# Altium project Lion tracker.PrjPCB (part 1 of 3)
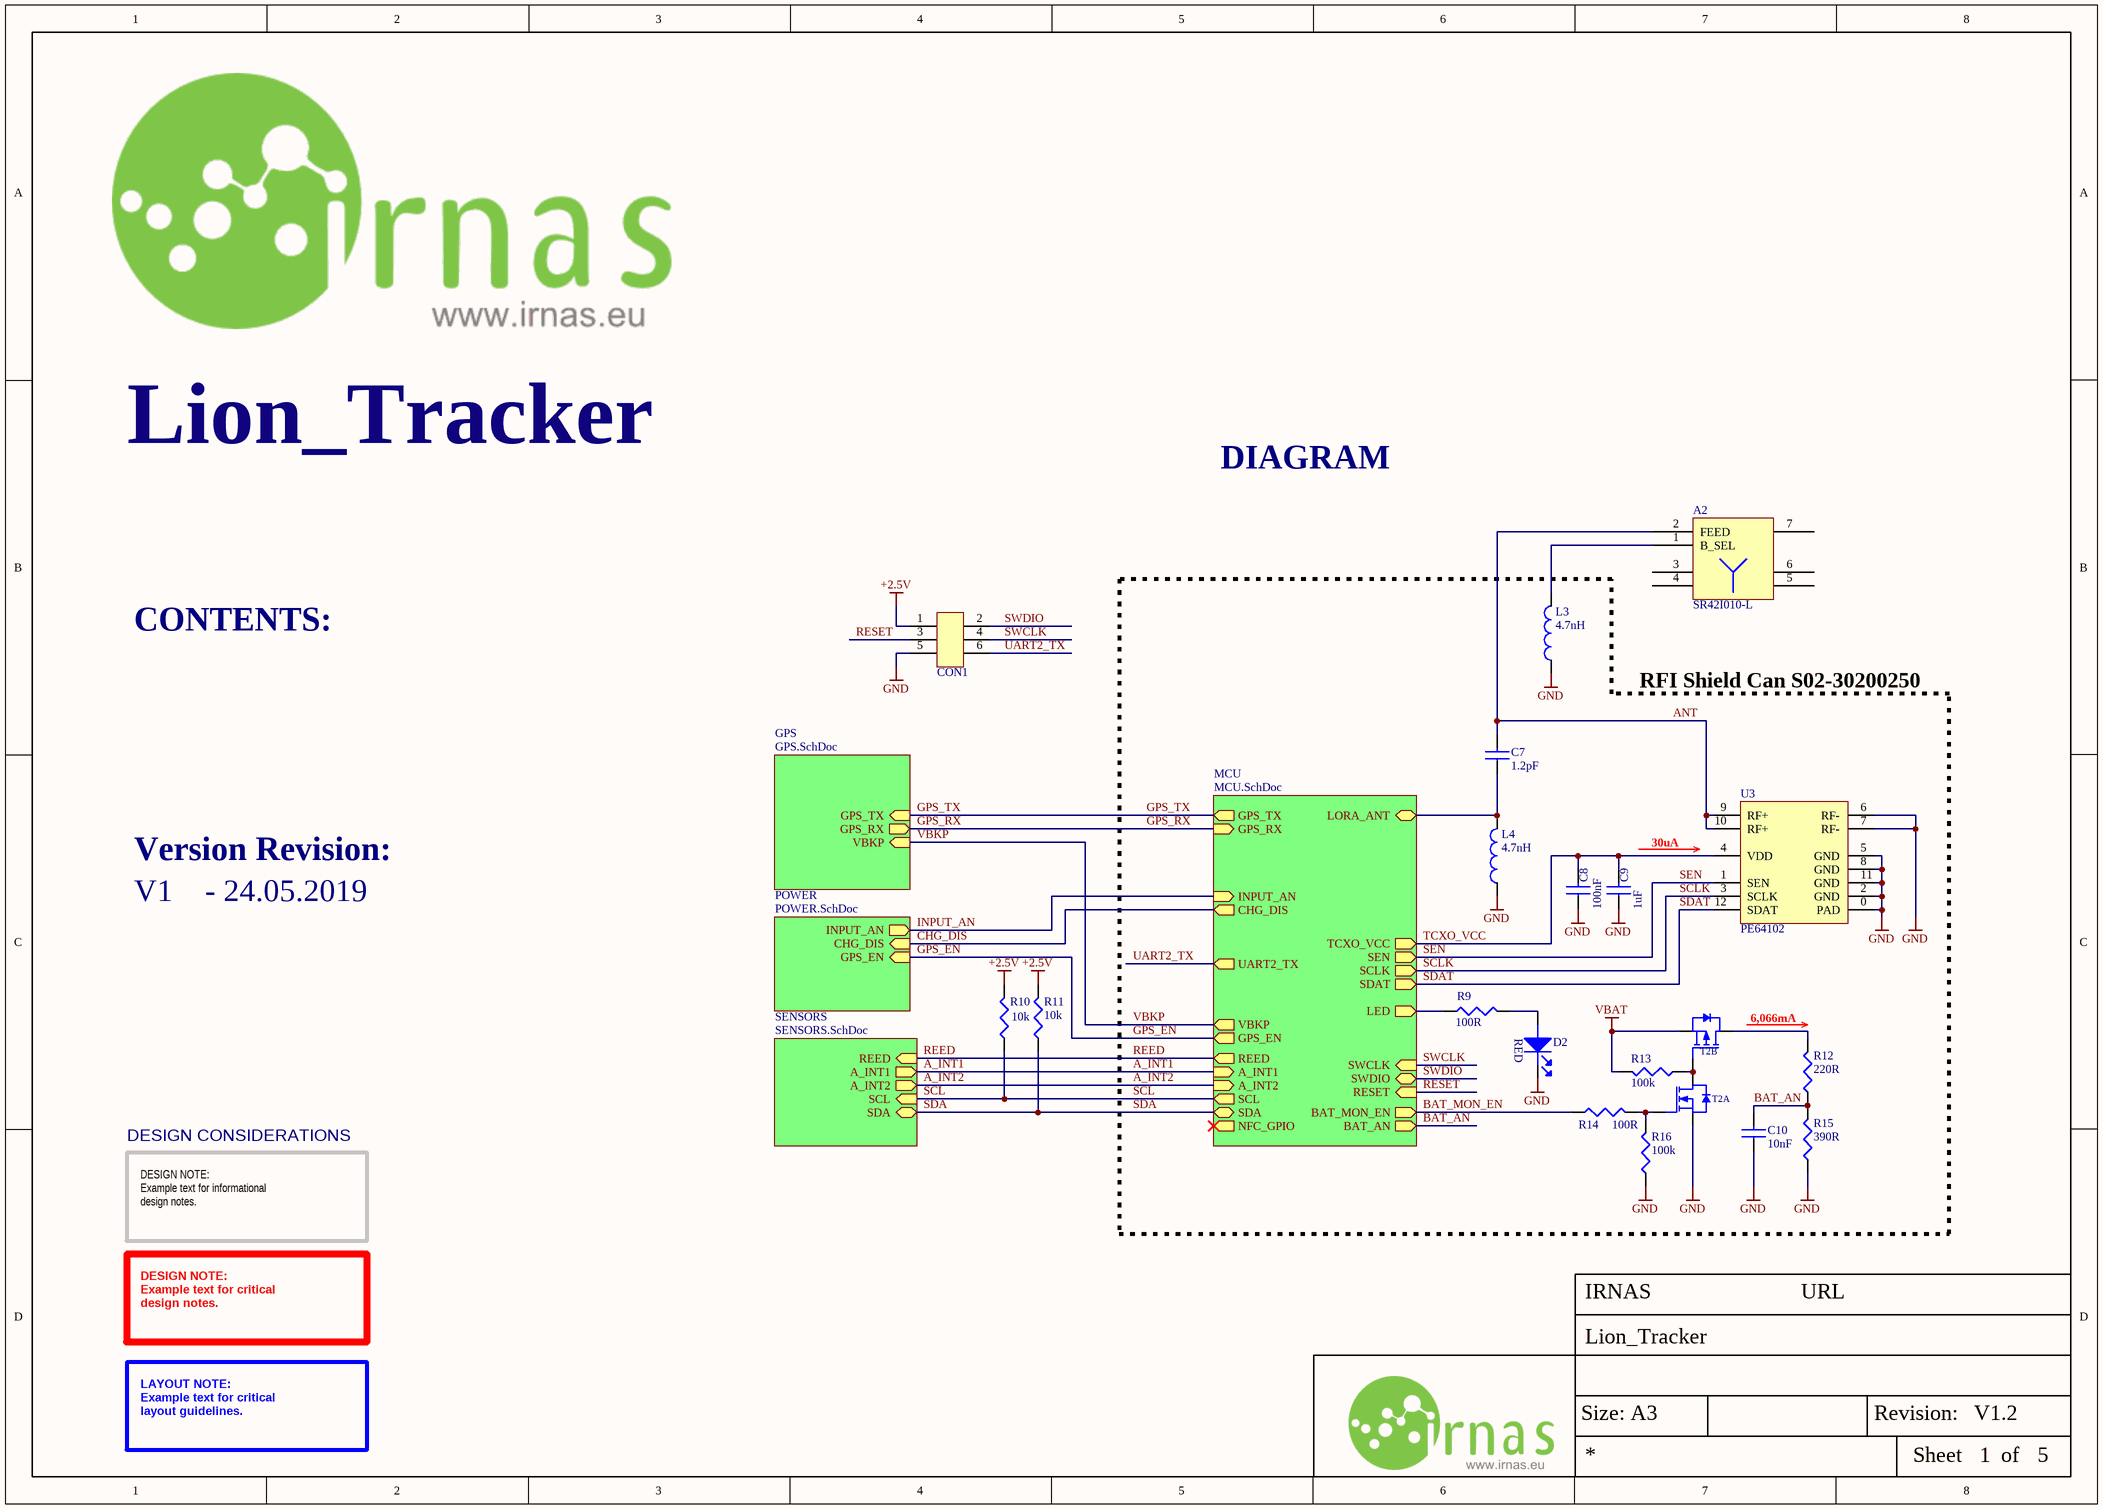
[diagram p0: MAIN.SchDoc]
Company: IRNAS; CreateDate: 25.09.2019; PCBDesigner: Aleksej Cegner; ProjectTitle: Lion_Tracker; RevisionDate: 29.10.2019; Version: V1.2; Website: URL
4 sheets, 116 parts. Net scope: hierarchical (ports join the sheet entries above them; power ports are global).
Board files: LION_TRACKER.PcbDoc, LION_TRACKER_PANEL.PcbDoc
Sheets:
  MAIN.SchDoc
    SENSORS = SENSORS.SchDoc
    MCU = MCU.SchDoc
    POWER = POWER.SchDoc

## Sheet MAIN.SchDoc
size A3; DocumentNumber: 1; SheetNumber: 1; SheetTotal: 5

### Parts
A2  SR42I010-L  [SR42I010-L]
C7  1.2pF  [CAP0402]
C8  100nF  [CAP0402]
C9  1uF  [CAP0402]
C10  10nF  [CAP0402]
CON1  Tag connect  [TC2030-IDC-NL]  (value not drawn)  (no BOM)
D2  LED RED  [LED0603]  (value not drawn)
L3  4.7nH  [IND0402]
L4  4.7nH  [IND0402]
R9  100R  [RES0402]
R10  10k  [RES0402]
R11  10k  [RES0402]
R12  220R  [RES0402]
R13  100k  [RES0402]
R14  100R  [RES0402]
R15  390R  [RES0402]
R16  100k  [RES0402]
T2  VT6M1T2CR  [VMT6]  (value not drawn)  (parts A,B of 2)
U3  PE64102  [QFN-12]

### Sub-sheets
GPS = GPS.SchDoc (file not in this document): VBKP (in), GPS_RX (out), GPS_TX (in)
MCU = MCU.SchDoc: RESET (in), GPS_RX (in), SCL (out), LORA_ANT (bidir), SWDIO (bidir), GPS_EN (out), GPS_TX (out), SWCLK (in), SDA (bidir), A_INT2 (in), A_INT1 (in), REED (out), VBKP (out), BAT_AN (out), BAT_MON_EN (out), LED (out), UART2_TX (out), NFC_GPIO (out), SDAT (out), SCLK (out), SEN (out), INPUT_AN (in), CHG_DIS (out), TCXO_VCC (out)
POWER = POWER.SchDoc: GPS_EN (in), CHG_DIS (in), INPUT_AN (out)
SENSORS = SENSORS.SchDoc: SCL (in), SDA (bidir), REED (in), A_INT2 (out), A_INT1 (out)

### Nets
+2.5V: CON1.1 R10.2 R11.2
GND: C8.1 C9.1 C10.1 CON1.5 D2.1(cathode) L3.1 L4.1 R15.1 R16.1 T2.1(S1) U3.0(PAD) U3.2(GND) U3.5(GND) U3.6(RF-) U3.7(RF-) U3.8(GND) U3.11(GND)
VBAT: R13.2 T2.4(S2)
A_INT1: sheet SENSORS/A_INT1, sheet MCU/A_INT1
A_INT2: sheet SENSORS/A_INT2, sheet MCU/A_INT2
ANT: A2.2(FEED) C7.2 U3.9(RF+) U3.10(RF+)
BAT_AN: C10.2 R12.1 R15.2 ; sheet MCU/BAT_AN
BAT_MON_EN: R14.1 ; sheet MCU/BAT_MON_EN
CHG_DIS: sheet MCU/CHG_DIS, sheet POWER/CHG_DIS
GPS_EN: sheet MCU/GPS_EN, sheet POWER/GPS_EN
GPS_RX: sheet MCU/GPS_RX, sheet GPS/GPS_RX
GPS_TX: sheet MCU/GPS_TX, sheet GPS/GPS_TX
INPUT_AN: sheet MCU/INPUT_AN, sheet POWER/INPUT_AN
LED: R9.1 ; sheet MCU/LED
LORA_ANT: C7.1 L4.2 ; sheet MCU/LORA_ANT
REED: sheet SENSORS/REED, sheet MCU/REED
RESET: CON1.3 ; sheet MCU/RESET
SCL: R10.1 ; sheet SENSORS/SCL, sheet MCU/SCL
SCLK: U3.3(SCLK) ; sheet MCU/SCLK
SDA: R11.1 ; sheet SENSORS/SDA, sheet MCU/SDA
SDAT: U3.12(SDAT) ; sheet MCU/SDAT
SEN: U3.1(SEN) ; sheet MCU/SEN
SWCLK: CON1.4 ; sheet MCU/SWCLK
SWDIO: CON1.2 ; sheet MCU/SWDIO
TCXO_VCC: C8.2 C9.2 U3.4(VDD) ; sheet MCU/TCXO_VCC
UART2_TX: CON1.6 ; sheet MCU/UART2_TX
VBKP: sheet MCU/VBKP, sheet GPS/VBKP
NetA2_1: A2.1(B_SEL) L3.2
NetD2_2: D2.2(ANODE) R9.2
NetR12_2: R12.2 T2.3(D2)
NetR13_1: R13.1 T2.5(G2) T2.6(D1)
NetR14_2: R14.2 R16.2 T2.2(G1)

Not connected (* = marked no-connect by the designer): A2 3 4 5 6 7

### Notes on the sheet
- DIAGRAM
- CONTENTS:
- RFI Shield Can S02-30200250
- 30uA
- Version Revision:
- V1    - 24.05.2019
- 6,066mA
- DESIGN CONSIDERATIONS
- DESIGN NOTE:
  Example text for informational
  design notes.
- DESIGN NOTE:
  Example text for critical
  design notes.
- LAYOUT NOTE:
  Example text for critical
  layout guidelines.
- Size: A3
- Revision:
- Sheet
- of
- (in symbol LED - LED RED) RED

### Library data of the parts
A2 = ANT - SR42I010-L: Antenna SMD -4dBi Gain 870MHz/928MHz Automotive 7-Pin SMD T/R; Manufacturer: Antenova; Manufacturer Part Number: SR42I010-R; Stock 1: 3154; Pricing 1: 1 = 2.36000, 10 = 1.90000, 50 = 1.90000, 100 = 1.52000, 1000 = 1.07000, 10000 = 0.95900 (USD); Supplier 1: Mouser; Supplier Part Number 1: 237-SR42I010-L
C7 = C - 4.7nF/0402: CAP CER 4700PF 50V X7R 0402; Manufacturer: KEMET; Manufacturer Part Number: C0402C472K5RAC-TU; IRNAS Part No.: /; Dielectric Material: Ceramic; Capacitance: 4.7nF; Tolerance: 10%; Supplier 1: Farnell; Stock 1: 98953; Pricing 1: 10=0.0321, 100=0.0144, 500=0.0081, 2500=0.0057, 5000=0.0048 (EUR); Mount: Surface Mount,PCB; Case/Package: 0402; Number of Pins: 2; Case Code (Imperial): 0402; Case Code (Metric): 1005; Min Operating Temperature: -55°C; Max Operating Temperature: 125°C; Voltage Rating: 50V; Voltage Rating (DC): 50V; Packaging: Tape and Reel; Package Quantity: 1; Dielectric: X7R; Termination: SMD/SMT; Voltage: 50V; Length: 1mm; Height: 0.5mm; Width: 0.02inch; Lead Pitch: 0.3mm; Thickness: 0.022inch; Depth: 0.5mm; Radiation Hardening: No; REACH SVHC: No SVHC; ComponentLink1URL: https://datasheet.ciiva.com/7747/40889-7747549.pdf; ComponentLink1Description: https://datasheet.ciiva.com/7747/40889-7747549.pdf; ComponentLink2URL: https://datasheet.ciiva.com/7747/40889-7747550.pdf; ComponentLink2Description: https://datasheet.ciiva.com/7747/40889-7747550.pdf; ComponentLink3URL: https://datasheet.ciiva.com/14604/70095383-14604382.pdf; ComponentLink3Description: https://datasheet.ciiva.com/14604/70095383-14604382.pdf; ComponentLink4URL: https://datasheet.ciiva.com/6074/kem-c1002-x7r-smd-6074645.pdf; ComponentLink4Description: https://datasheet.ciiva.com/6074/kem-c1002-x7r-smd-6074645.pdf; ComponentLink5URL: https://datasheet.ciiva.com/14602/70095383-14602057.pdf; ComponentLink5Description: https://datasheet.ciiva.com/14602/70095383-14602057.pdf; ComponentLink6URL: https://datasheet.ciiva.com/18102/getdatasheetpartid-63228-18102058.pdf; ComponentLink6Description: https://datasheet.ciiva.com/18102/getdatasheetpartid-63228-18102058.pdf; Supplier Part Number 1: 1414594
C8 = C - 100nF/0402: MULTICOMP         MC0402X104J160CT             SMD Multilayer Ceramic Capacitor, 0402 [1005 Metric], 0.1 F, 16 V,  5%, X5R, MC Series                          New; IRNAS Part No.: /; Voltage Rating: 16V; Supplier 1: Farnell; Manufacturer: Multicomp; Manufacturer Part Number: MC0402X104J160CT; Stock 1: 3230; Pricing 1: 10=0.0139, 100=0.0108, 500=0.0076, 2500=0.0051, 5000=0.0038 (EUR); Case Code (Metric): 1005; Case Code (Imperial): 0402; Min Operating Temperature: -55°C; Max Operating Temperature: 85°C; Capacitance: 100nF; Dielectric: X5R; Packaging: Tape and Reel; Tolerance: 5%; Voltage Rating (DC): 16V; REACH SVHC: No SVHC; ComponentLink1URL: http://www.farnell.com/datasheets/2117933.pdf; ComponentLink1Description: http://www.farnell.com/datasheets/2117933.pdf; ComponentLink2URL: http://www.farnell.com/datasheets/2117900.pdf; ComponentLink2Description: http://www.farnell.com/datasheets/2117900.pdf; Supplier Part Number 1: 2627419
C9 = C - 1uF/0402: CAP CER 1UF 10V 20% X5R 0402; Manufacturer: Murata; Manufacturer Part Number: GRM155R61A105ME15D; IRNAS Part No.: /; Supplier 1: Farnell; Stock 1: 0; Pricing 1: 10=0.0379, 100=0.0266, 500=0.0156, 2500=0.0098, 5000=0.0083 (EUR); Mount: Surface Mount; Case/Package: 0402; Case Code (Metric): 1005; Case Code (Imperial): 0402; Min Operating Temperature: -55°C; Max Operating Temperature: 85°C; Capacitance: 1uF; Tolerance: 20%; Voltage Rating: 10V; Packaging: Tape and Reel; Package Quantity: 1; Dielectric: X5R; Voltage: 10V; Voltage Rating (DC): 10V; Length: 1mm; Height: 0.5mm; Width: 0.02inch; Thickness: 0.022inch; Depth: 0.5mm; Radiation Hardening: No; REACH SVHC: No SVHC; Lead Free: Lead Free; ComponentLink1URL: https://datasheet.ciiva.com/164/product-164665.pdf; ComponentLink1Description: https://datasheet.ciiva.com/164/product-164665.pdf; ComponentLink2URL: https://datasheet.ciiva.com/11616/product-11616508.pdf; ComponentLink2Description: https://datasheet.ciiva.com/11616/product-11616508.pdf; ComponentLink3URL: https://datasheet.ciiva.com/46418/1769893-46418047.pdf; ComponentLink3Description: https://datasheet.ciiva.com/46418/1769893-46418047.pdf; ComponentLink4URL: https://datasheet.ciiva.com/164/partnumbering-e-01-164666.pdf; ComponentLink4Description: https://datasheet.ciiva.com/164/partnumbering-e-01-164666.pdf; ComponentLink5URL: https://datasheet.ciiva.com/164/partnumbering-e-01-164667.pdf; ComponentLink5Description: https://datasheet.ciiva.com/164/partnumbering-e-01-164667.pdf; Supplier Part Number 1: 2426953
C10 = C - 10nF/0402: CAP CER 10000PF 16V X7R 0402; Manufacturer: Murata; Manufacturer Part Number: GRM155R71C103KA01D; IRNAS Part No.: /; Tolerance: 10%; Supplier 1: Farnell; Stock 1: 16478; Pricing 1: 10=0.0216, 100=0.0151, 500=0.0104, 2500=0.0069, 5000=0.0056 (EUR); Mount: Surface Mount; Case/Package: 0402; Number of Pins: 2; Case Code (Metric): 1005; Case Code (Imperial): 0402; Min Operating Temperature: -55°C; Max Operating Temperature: 125°C; Package Quantity: 1; Capacitance: 10nF; Voltage Rating: 16V; Packaging: Tape and Reel; Voltage Rating (DC): 16V; Dielectric: X7R; Termination: SMD/SMT; Voltage: 16V; Length: 1mm; Height: 0.5mm; Width: 0.02inch; Thickness: 0.022inch; Depth: 0.5mm; Radiation Hardening: No; REACH SVHC: No SVHC; Lead Free: Lead Free; ComponentLink1URL: https://datasheet.ciiva.com/129/partnumbering-e-01-129774.pdf; ComponentLink1Description: https://datasheet.ciiva.com/129/partnumbering-e-01-129774.pdf; ComponentLink2URL: https://datasheet.ciiva.com/129/partnumbering-e-01-129775.pdf; ComponentLink2Description: https://datasheet.ciiva.com/129/partnumbering-e-01-129775.pdf; ComponentLink3URL: https://datasheet.ciiva.com/129/product-129776.pdf; ComponentLink3Description: https://datasheet.ciiva.com/129/product-129776.pdf; ComponentLink4URL: https://datasheet.ciiva.com/18184/getdatasheetpartid-178863-18184649.pdf; ComponentLink4Description: https://datasheet.ciiva.com/18184/getdatasheetpartid-178863-18184649.pdf; ComponentLink5URL: https://datasheet.ciiva.com/22698/608985-22698415.pdf; ComponentLink5Description: https://datasheet.ciiva.com/22698/608985-22698415.pdf; ComponentLink6URL: https://datasheet.ciiva.com/7937/608985-7937614.pdf; ComponentLink6Description: https://datasheet.ciiva.com/7937/608985-7937614.pdf; Supplier Part Number 1: 1828864
CON1 = tag connecot 6 pin
D2 = LED - LED RED: BROADCOM LIMITED - HSMS-C190 - LED, RED, 10MCD, 626NM; LED Mounting: SMD; Forward Current If: 20; Forward Voltage: 2.1; Wavelength Typ: 626; Luminous Intensity: 10; Viewing Angle: 170°; Lens Shape: Rectangular; SVHC: No SVHC (17-Dec-2015)<!--FANDB--><div class="features-and-benefits-container"><div class="features-and-benefits-description"><span class="features-benefits-value">The HSMS-C190 is a HER SMD Chip LED with untinted/diffused lens, made of GaP. It is designed in an industry standard package 1.6 x 0.8mm footprint with 0.8mm profile. It is compatible with IR reflow solder processes. The small size and wide viewing angle make this LED prime choices for backlighting applications and front panel illumination especially where space is a premium.</span></div><div class="features-and-benefits-list"><ul class="features-and-benefits-list-list"><li class="features-and-benefits-list-item">Small size</li><li class="features-and-benefits-list-item">Industry standard footprint</li><li class="features-and-benefits-list-item">Compatible with IR solder</li><li class="features-and-benefits-list-item">Diffused optics</li><li class="features-and-benefits-list-item">-40 to 85; Supplier 1: Farnell; Manufacturer: BROADCOM LIMITED; Manufacturer Part Number: HSMS-C190; RoHS: YES; Stock 1: 7534; Pricing 1: 1=0.361, 10=0.256, 50=0.235, 100=0.106, 200=0.101 (GBP); LED Colour: Red; Bulb Size: -; Packaging: Cut Tape; Product Range: -; Automotive Qualification Standard: -; MSL: -; ComponentLink1URL: http://www.farnell.com/datasheets/313031.pdf; ComponentLink1Description: http://www.farnell.com/datasheets/313031.pdf; ComponentLink2URL: http://www.farnell.com/datasheets/1681524.pdf; ComponentLink2Description: http://www.farnell.com/datasheets/1681524.pdf; ComponentLink3URL: http://www.farnell.com/datasheets/2165483.pdf; ComponentLink3Description: http://www.farnell.com/datasheets/2165483.pdf; Supplier Part Number 1: 2497356
L3 L4 = L - 4.3nH/0402: Inductor RF Chip Multi-Layer 4.3nH 0.3nH 100MHz 8Q-Factor Air 300mA 210mOhm DCR 0402 Paper T/R; Manufacturer: Murata; Manufacturer Part Number: LQG15HN4N3S02D; IRNAS Part No.: /; Q Factor: 8; Self Resonant Frequency: 6GHz; Shielding: Unshielded; DC Resistance (DCR): 210mR; Stock 1: 3502; Pricing 1: 1 = 0.10000, 10 = 0.06100, 100 = 0.04040, 500 = 0.03366, 1000 = 0.02827, 2500 = 0.02423 (USD); RoHS: Yes; Mount: Surface Mount; Case/Package: 0402; Core Material: Air; Case Code (Metric): 1005; Case Code (Imperial): 0402; Min Operating Temperature: -55°C; Max Operating Temperature: 125°C; Package Quantity: 10000; Packaging: Tape and Reel; Current Rating: 300mA; Inductance: 4.3nh; Test Frequency: 100MHz; Max DC Current: 300mA; Termination: SMD/SMT; Current: 300mA; DC Current: 300mA; Military Standard: Not; Length: 1.05mm; Height: 0.5mm; Width: 0.02inch; Height - Seated (Max): 0.022inch; Depth: 0.55mm; Radiation Hardening: No; REACH SVHC: No SVHC; Lead Free: Lead Free; ComponentLink1URL: http://uk.rs-online.com/webdocs/0f10/0900766b80f10808.pdf?src-supplier=RSComponents; ComponentLink1Description: http://uk.rs-online.com/webdocs/0f10/0900766b80f10808.pdf?src-supplier=RSComponents; ComponentLink2URL: http://search.murata.co.jp/Ceramy/image/img/PDF/ENG/L0075S0083LQG15HN.pdf?src-supplier=Avnet; ComponentLink2Description: http://search.murata.co.jp/Ceramy/image/img/PDF/ENG/L0075S0083LQG15HN.pdf?src-supplier=Avnet; ComponentLink3URL: http://www.farnell.com/datasheets/66026.pdf?src-supplier=Element14; ComponentLink3Description: http://www.farnell.com/datasheets/66026.pdf?src-supplier=Element14; ComponentLink4URL: https://www.verical.com/server-webapp/html/getDatasheet?partID=31252&src-supplier=Verical; ComponentLink4Description: https://www.verical.com/server-webapp/html/getDatasheet?partID=31252&src-supplier=Verical; ComponentLink5URL: http://search.murata.co.jp/Ceramy/image/img/PDF/ENG/L0075S0083LQG15HN.pdf?src-supplier=Avnet+Europe; ComponentLink5Description: http://search.murata.co.jp/Ceramy/image/img/PDF/ENG/L0075S0083LQG15HN.pdf?src-supplier=Avnet+Europe; ComponentLink6URL: https://search.murata.co.jp/Ceramy/image/img/P02/partnumberingAT_LQ3E.pdf?src-supplier=Digi-Key; ComponentLink6Description: https://search.murata.co.jp/Ceramy/image/img/P02/partnumberingAT_LQ3E.pdf?src-supplier=Digi-Key; Supplier 1: Farnell; Supplier Part Number 1: 1711735
R9 R14 = R - 100R/0402: MULTICOMP         MCMR04X1000FTL            SMD Chip Resistor, Ceramic, MCMR Series, 100 ohm, 50 V, 0402 [1005 Metric], 62.5 mW,  1%; IRNAS Part No.: /; Temperature Coefficient: 100ppm/°C; Power Rating: 62.5mW; Voltage Rating: 50V; Supplier 1: Farnell; Manufacturer: Multicomp; Manufacturer Part Number: MCMR04X1000FTL; Stock 1: 62365; Pricing 1: 10=0.0071, 100=0.0042, 500=0.003, 2500=0.0024, 5000=0.0019 (GBP); Case/Package: 0402; Case Code (Metric): 1005; Case Code (Imperial): 0402; Resistance: 100R; Tolerance: 1%; Composition: Ceramic; Packaging: Cut Tape; Voltage Rating (DC): 50V; REACH SVHC: No SVHC; ComponentLink1URL: https://datasheet.ciiva.com/28692/1716705-28692087.pdf; ComponentLink1Description: https://datasheet.ciiva.com/28692/1716705-28692087.pdf; ComponentLink2URL: https://datasheet.ciiva.com/22708/1716705-22708156.pdf; ComponentLink2Description: https://datasheet.ciiva.com/22708/1716705-22708156.pdf; Supplier Part Number 1: 2072515
R10 R11 = R - 10k/0402: MULTICOMP         MCWR04X1002FTL             SMD Chip Resistor, Thick Film, 10 kohm, 50 V, 0402 [1005 Metric], 62.5 mW,  1%, MCWR Series; IRNAS Part No.: I-100014; Resistance: 10kR; Voltage Rating: 50V; Power Rating: 62.5mW; Temperature Coefficient: 100ppm/°C; Supplier 1: Farnell; Manufacturer: Multicomp; Manufacturer Part Number: MCWR04X1002FTL; Stock 1: 602609; Pricing 1: 10=0.0029, 100=0.0017, 500=0.0012, 2500=0.001, 5000=0.0008 (EUR); Case/Package: 0402; Case Code (Metric): 1005; Case Code (Imperial): 0402; Packaging: Cut Tape; Composition: Thick Film; Tolerance: 1%; Voltage Rating (DC): 50V; REACH SVHC: No SVHC; ComponentLink1URL: http://www.farnell.com/datasheets/1849611.pdf; ComponentLink1Description: http://www.farnell.com/datasheets/1849611.pdf; Supplier Part Number 1: 2447096
R12 = R - 220R/0402: SMD Chip Resistor, 0402 [1005 Metric], 220 ohm, CRCW e3 Series, 50 V, Thick Film, 63 mW; Manufacturer: Multicomp; IRNAS Part No.: /; Voltage Rating: 50V; Power Rating: 62.5mW; Temperature Coefficient: 400ppm/°C; Stock 1: 0; Pricing 1: 10=0.0057, 100=0.0034, 500=0.0024, 2500=0.0019, 5000=0.0015 (EUR); Case/Package: 0402; Case Code (Metric): 1005; Case Code (Imperial): 0402; Packaging: Cut Tape; Resistance: 220R; Composition: Ceramic; Voltage Rating (DC): 50V; REACH SVHC: No SVHC; ComponentLink1URL: http://www.farnell.com/datasheets/2310790.pdf?_ga=2.80708247.1822379758.1564985606-1373726713.1554121096&_gac=1.157944520.1562763802.CjwKCAjwmZbpBRAGEiwADrmVXm8xT8OHDZvJe8qZIQyyGmIuiUD-TEITatw0hIdDkyBwIXXCH7oneRoCl7cQAvD_BwE; ComponentLink1Description: Datasheet; Supplier 1: Farnell; Supplier Part Number 1: 2140704
R13 R16 = R - 100k/0402: MULTICOMP   MCWR04X1003FTL   RES, THICK FILM, 100KOHM, 1%, 0.0625W; IRNAS Part No.: I-100013; Resistance: 100kR; Power Rating: 62.5mW; Voltage Rating: 50V; Temperature Coefficient: 100ppm/°C; Supplier 1: Farnell; Manufacturer: Multicomp; Manufacturer Part Number: MCWR04X1003FTL; Stock 1: 161188; Pricing 1: 10=0.0029, 100=0.0017, 500=0.0012, 2500=0.001, 5000=0.0008 (EUR); Mount: Surface Mount; Case/Package: 0402; Case Code (Metric): 1005; Case Code (Imperial): 0402; Tolerance: 1%; Packaging: Cut Tape; Composition: Thick Film; Voltage Rating (DC): 50V; REACH SVHC: No SVHC; ComponentLink1URL: https://datasheet.ciiva.com/46386/1849611-46386524.pdf; ComponentLink1Description: https://datasheet.ciiva.com/46386/1849611-46386524.pdf; Supplier Part Number 1: 2447094
R15 = R - 390R/0402: SMD Chip Resistor, 0402 [1005 Metric], 390 ohm, MCWR Series, 50 V, Thick Film, 62.5 mW; Manufacturer: Multicomp; IRNAS Part No.: /; Voltage Rating: 50V; Power Rating: 62.5mW; Temperature Coefficient: 400ppm/°C; Stock 1: 0; Pricing 1: 10=0.0057, 100=0.0034, 500=0.0024, 2500=0.0019, 5000=0.0015 (EUR); Case/Package: 0402; Case Code (Metric): 1005; Case Code (Imperial): 0402; Packaging: Cut Tape; Resistance: 390R; Composition: Ceramic; Voltage Rating (DC): 50V; REACH SVHC: No SVHC; ComponentLink1URL: http://www.farnell.com/datasheets/2563624.pdf?_ga=2.57959210.1822379758.1564985606-1373726713.1554121096&_gac=1.48955732.1562763802.CjwKCAjwmZbpBRAGEiwADrmVXm8xT8OHDZvJe8qZIQyyGmIuiUD-TEITatw0hIdDkyBwIXXCH7oneRoCl7cQAvD_BwE; ComponentLink1Description: Datasheet; Supplier 1: Farnell; Supplier Part Number 1: 2447165
T2 = T_M - VT6M1T2CR: Dual MOSFET, N and P Channel, 100 mA, 20 V, 2.5 ohm, 4.5 V, 1 V; ELRAD Id sifra / ELRAD Id No: 597778; Opis / Description: MOSFET BSS123       /N-Channel; Komp / Device: SMD; Value: BSS123; Velikost / Size: SOT23; FIT: 0.44; Author: Ciril Golob; Date: 11.07.2018; ComponentLINK1Description: Datasheet; ComponentLINK2Description: Datasheet www; ComponentLINK1URL: c:\ELRADSVN\Altium_Library\Libraries\Active\Datasheet\BSS123.pdf; ComponentLINK2URL: http://www.onsemi.com/pub/Collateral/BSS123-D.PDF; ComponentLink1Description: Datasheet; ComponentLink1URL: http://www.farnell.com/datasheets/2198041.pdf?_ga=2.191543850.1451481302.1563774341-1373726713.1554121096&_gac=1.95045230.1562763802.CjwKCAjwmZbpBRAGEiwADrmVXm8xT8OHDZvJe8qZIQyyGmIuiUD-TEITatw0hIdDkyBwIXXCH7oneRoCl7cQAvD_BwE; Supplier 1: Farnell; Supplier Part Number 1: 2706721
U3 = RF - PE64102: RF IC Digitally Tunable Capacitor General Purpose 100MHz ~ 3GHz SPI Interface 12-QFN (2x2); Manufacturer: u-blox; Manufacturer Part Number: MAX-M8Q-0; Stock 1: 10805; Supplier 1: Digi-Key; Supplier Part Number 1: 1046-1066-1-ND

## Sheet SENSORS.SchDoc
size A3; DocumentNumber: 5; SheetNumber: 5; SheetTotal: 5
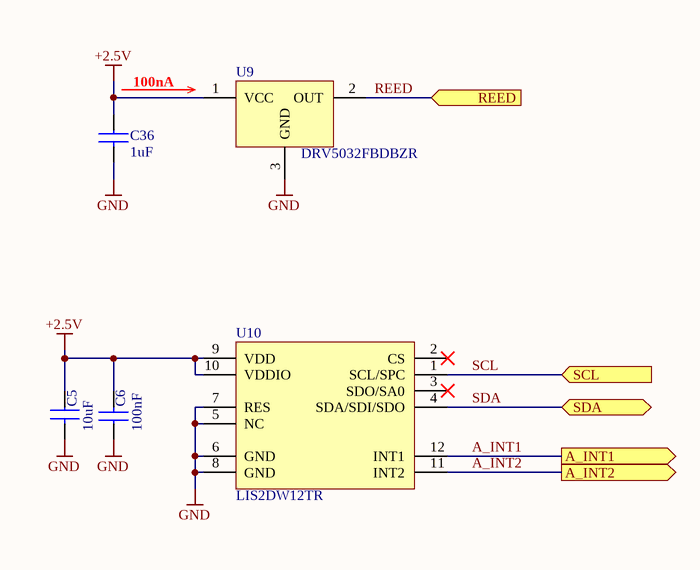
[diagram p1: SENSORS.SchDoc]

### Parts
C5  10uF  [CAP0603]
C6  100nF  [CAP0402]
C36  1uF  [CAP0402]
U9  DRV5032FBDBZR  [SOT23-3AL]
U10  LIS2DW12TR  [LGA-12]

### Ports
A_INT1 (out), A_INT2 (out), REED (in), SCL (in), SDA (bidir)

### Nets
+2.5V: C5.1 C6.2 C36.1 U9.1(VCC) U10.9(VDD) U10.10(VDDIO)
GND: C5.2 C6.1 C36.2 U9.3(GND) U10.5(NC) U10.6(GND) U10.7(RES) U10.8(GND)
A_INT1: U10.12(INT1) ; port A_INT1
A_INT2: U10.11(INT2) ; port A_INT2
REED: U9.2(OUT) ; port REED
SCL: U10.1(SCL/SPC) ; port SCL
SDA: U10.4(SDA/SDI/SDO) ; port SDA

Not connected (* = marked no-connect by the designer): U10 2(CS)* 3(SDO/SA0)*

### Notes on the sheet
- 100nA
- Size: A3
- Revision:
- Sheet
- of

### Library data of the parts
C5 = C - 10uF/10V: Cap Ceramic 10uF 10V X5R 10% SMD 0603 85C Paper T/R; Manufacturer: Samsung; Manufacturer Part Number: CL10A106KP8NNNC; IRNAS Part No.: /; Stock 1: 2844657; Pricing 1: 1=0.36, 10=0.248, 100=0.1403, 500=0.099, 1000=0.08663 (USD); Mount: Surface Mount; Case/Package: 0603; Case Code (Metric): 1608; Case Code (Imperial): 0603; Material: Ceramic; Contact Plating: Tin; Min Operating Temperature: -55°C; Max Operating Temperature: 85°C; Capacitance: 10uF; Tolerance: 10%; Package Quantity: 1; Packaging: Tape and Reel; Voltage Rating: 10V; Dielectric: X5R; Voltage Rating (DC): 10V; Length: 1.6mm; Height: 0.8mm; Width: 0.031inch; Thickness: 0.035inch; Depth: 0.8mm; Radiation Hardening: No; Lead Free: Lead Free; ComponentLink1URL: https://www.verical.com/server-webapp/html/getDatasheet?partID=359551; ComponentLink1Description: https://www.verical.com/server-webapp/html/getDatasheet?partID=359551; ComponentLink2URL: http://www1.futureelectronics.com/doc/SAMSUNG%20PASSIVE/CL05B104KQ5NNNC.pdf; ComponentLink2Description: http://www1.futureelectronics.com/doc/SAMSUNG%20PASSIVE/CL05B104KQ5NNNC.pdf; ComponentLink3URL: https://produktinfo.conrad.com/datenblaetter/450000-474999/457369-da-01-en-VS_KONDENSATOR_0603.pdf; ComponentLink3Description: https://produktinfo.conrad.com/datenblaetter/450000-474999/457369-da-01-en-VS_KONDENSATOR_0603.pdf; Supplier 1: Farnell; Supplier Part Number 1: 2456110
C6 = C - 100nF/0402: as C8 on sheet MAIN; Supplier 1: Farnell; Manufacturer: Multicomp; Manufacturer Part Number: MC0402X104J160CT; Stock 1: 3230; Pricing 1: 10=0.0139, 100=0.0108, 500=0.0076, 2500=0.0051, 5000=0.0038 (EUR); Case Code (Metric): 1005; Case Code (Imperial): 0402; Min Operating Temperature: -55°C; Max Operating Temperature: 85°C; Capacitance: 100nF; Dielectric: X5R; Packaging: Tape and Reel; Tolerance: 5%; Voltage Rating (DC): 16V; REACH SVHC: No SVHC; ComponentLink1URL: http://www.farnell.com/datasheets/2117933.pdf; ComponentLink1Description: http://www.farnell.com/datasheets/2117933.pdf; ComponentLink2URL: http://www.farnell.com/datasheets/2117900.pdf; ComponentLink2Description: http://www.farnell.com/datasheets/2117900.pdf; Supplier Part Number 1: 2627419
C36 = C - 1uF/0402: as C9 on sheet MAIN; Stock 1: 0; Pricing 1: 10=0.0379, 100=0.0266, 500=0.0156, 2500=0.0098, 5000=0.0083 (EUR); Mount: Surface Mount; Case/Package: 0402; Case Code (Metric): 1005; Case Code (Imperial): 0402; Min Operating Temperature: -55°C; Max Operating Temperature: 85°C; Capacitance: 1uF; Tolerance: 20%; Voltage Rating: 10V; Packaging: Tape and Reel; Package Quantity: 1; Dielectric: X5R; Voltage: 10V; Voltage Rating (DC): 10V; Length: 1mm; Height: 0.5mm; Width: 0.02inch; Thickness: 0.022inch; Depth: 0.5mm; Radiation Hardening: No; REACH SVHC: No SVHC; Lead Free: Lead Free; ComponentLink1URL: https://datasheet.ciiva.com/164/product-164665.pdf; ComponentLink1Description: https://datasheet.ciiva.com/164/product-164665.pdf; ComponentLink2URL: https://datasheet.ciiva.com/11616/product-11616508.pdf; ComponentLink2Description: https://datasheet.ciiva.com/11616/product-11616508.pdf; ComponentLink3URL: https://datasheet.ciiva.com/46418/1769893-46418047.pdf; ComponentLink3Description: https://datasheet.ciiva.com/46418/1769893-46418047.pdf; ComponentLink4URL: https://datasheet.ciiva.com/164/partnumbering-e-01-164666.pdf; ComponentLink4Description: https://datasheet.ciiva.com/164/partnumbering-e-01-164666.pdf; ComponentLink5URL: https://datasheet.ciiva.com/164/partnumbering-e-01-164667.pdf; ComponentLink5Description: https://datasheet.ciiva.com/164/partnumbering-e-01-164667.pdf; Supplier 1: Farnell; Supplier Part Number 1: 1740588
U9 = SEN - DRV5032FBDBZR: Board Mount Hall Effect/Magnetic Sensors LP HALL 32FBDBZR; Manufacturer: TDK InvenSense; Interface: I2C; Sensor Type: Accelerometer; Max Supply Voltage: 3.6V; Min Supply Voltage: 2.4V; Output Type: SPI; Manufacturer Part Number: MPU-9250; Stock 1: 0; RoHS: Yes; Mount: Surface Mount; Case/Package: QFN; Number of Pins: 24; Min Operating Temperature: -40°C; Max Operating Temperature: 85°C; Package Quantity: 1; Length: 3.1mm; Height: 1mm; Width: 3.1mm; ComponentLink1Description: Datasheet; ComponentLink1URL: http://www.ti.com/general/docs/suppproductinfo.tsp?distId=26&gotoUrl=http%3A%2F%2Fwww.ti.com%2Flit%2Fgpn%2Fdrv5032; Supplier 1: Mouser; Supplier Part Number 1: 595-DRV5032FBDBZR
U10 = SEN - LIS2DW12TR: MEMS Accelerometer, Digital, X, Y, Z, ± 2g, ± 4g, ± 8g, ± 16g, 1.62 V, 3.6 V; Manufacturer: TDK InvenSense; Interface: I2C; Max Supply Voltage: 3.6V; Min Supply Voltage: 2.4V; Output Type: SPI; Manufacturer Part Number: MPU-9250; Stock 1: 0; RoHS: Yes; Mount: Surface Mount; Case/Package: QFN; Number of Pins: 24; Min Operating Temperature: -40°C; Max Operating Temperature: 85°C; Package Quantity: 1; Sensor Type: Accelerometer; Length: 3.1mm; Height: 1mm; Width: 3.1mm; ComponentLink1Description: Datasheet; ComponentLink1URL: D:\altium\Altium_Library\Active\Datasheet\LIS2DW12TR.pdf; Supplier 1: Farnell; Supplier Part Number 1: 2849615

## Sheet MCU.SchDoc
size A3; DocumentNumber: 2; SheetNumber: 2; SheetTotal: 5
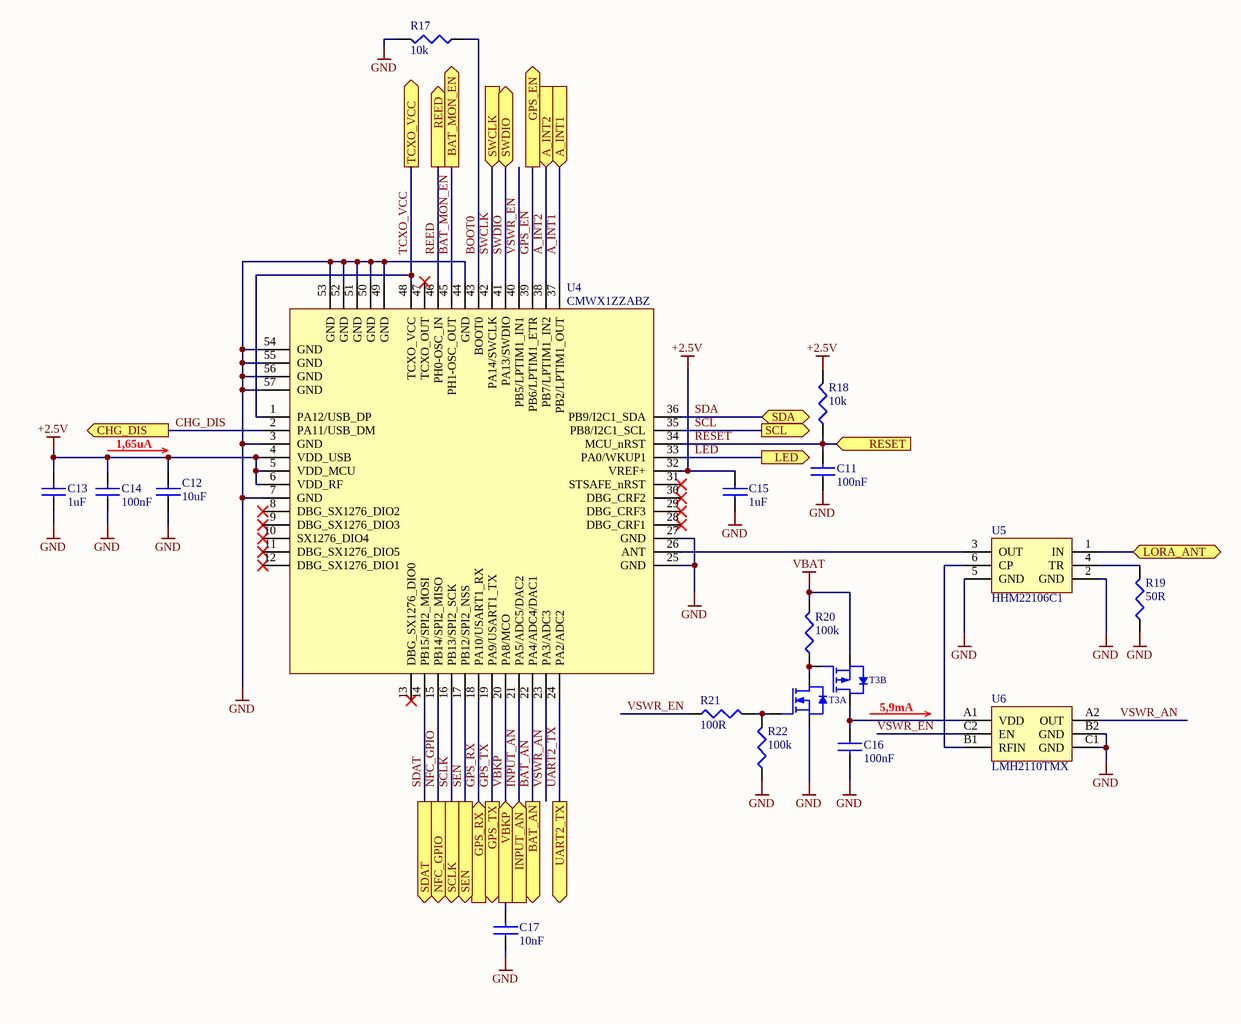
[diagram p2: MCU.SchDoc]

### Parts
C11  100nF  [CAP0402]
C12  10uF  [CAP0603]
C13  1uF  [CAP0402]
C14  100nF  [CAP0402]
C15  1uF  [CAP0402]
C16  100nF  [CAP0402]
C17  10nF  [CAP0402]
R17  10k  [RES0402]
R18  10k  [RES0402]
R19  50R  [RES0402]
R20  100k  [RES0402]
R21  100R  [RES0402]
R22  100k  [RES0402]
T3  VT6M1T2CR  [VMT6]  (value not drawn)  (parts A,B of 2)
U4  CMWX1ZZABZ  [Lora Module ES0]
U5  HHM22106C1  [HHM22106C1]
U6  LMH2110TMX  [DSBGA-6]

### Ports
A_INT1 (in), A_INT2 (in), BAT_AN (out), BAT_MON_EN (out), CHG_DIS (out), GPS_EN (out), GPS_RX (in), GPS_TX (out), INPUT_AN (in), LED (out), LORA_ANT (bidir), NFC_GPIO (out), REED (out), RESET (in), SCL (out), SCLK (out), SDA (bidir), SDAT (out), SEN (out), SWCLK (in), SWDIO (bidir), TCXO_VCC (out), UART2_TX (out), VBKP (out)

### Nets
+2.5V: C12.2 C13.2 C14.2 C15.2 R18.2 U4.4(VDD_USB) U4.5(VDD_MCU) U4.6(VDD_RF) U4.32(VREF+)
GND: C11.1 C12.1 C13.1 C14.1 C15.1 C16.2 C17.1 R17.2 R19.1 R22.1 T3.1(S1) U4.3(GND) U4.7(GND) U4.25(GND) U4.27(GND) U4.44(GND) U4.49(GND) U4.50(GND) U4.51(GND) U4.52(GND) U4.53(GND) U4.54(GND) U4.55(GND) U4.56(GND) U4.57(GND) U5.2(GND) U5.5(GND) U6.B2(GND) U6.C1(GND)
VBAT: R20.2 T3.4(S2)
A_INT1: U4.37(PB2/LPTIM1_OUT) ; port A_INT1
A_INT2: U4.38(PB7/LPTIM1_IN2) ; port A_INT2
BAT_AN: U4.22(PA4/ADC4/DAC1) ; port BAT_AN
BAT_MON_EN: U4.45(PH1-OSC_OUT) ; port BAT_MON_EN
BOOT0: R17.1 U4.43(BOOT0)
CHG_DIS: U4.2(PA11/USB_DM) ; port CHG_DIS
GPS_EN: U4.39(PB6/LPTIM1_ETR) ; port GPS_EN
GPS_RX: U4.18(PA10/USART1_RX) ; port GPS_RX
GPS_TX: U4.19(PA9/USART1_TX) ; port GPS_TX
INPUT_AN: U4.21(PA5/ADC5/DAC2) ; port INPUT_AN
LED: U4.33(PA0/WKUP1) ; port LED
LORA_ANT: U5.1(IN) ; port LORA_ANT
NFC_GPIO: U4.15(PB14/SPI2_MISO) ; port NFC_GPIO
REED: U4.46(PH0-OSC_IN) ; port REED
RESET: C11.2 R18.1 U4.34(MCU_nRST) ; port RESET
SCL: U4.35(PB8/I2C1_SCL) ; port SCL
SCLK: U4.16(PB13/SPI2_SCK) ; port SCLK
SDA: U4.36(PB9/I2C1_SDA) ; port SDA
SDAT: U4.14(PB15/SPI2_MOSI) ; port SDAT
SEN: U4.17(PB12/SPI2_NSS) ; port SEN
SWCLK: U4.42(PA14/SWCLK) ; port SWCLK
SWDIO: U4.41(PA13/SWDIO) ; port SWDIO
TCXO_VCC: U4.1(PA12/USB_DP) U4.48(TCXO_VCC) ; port TCXO_VCC
UART2_TX: U4.24(PA2/ADC2) ; port UART2_TX
VBKP: C17.2 U4.20(PA8/MCO) ; port VBKP
VSWR_AN: U4.23(PA3/ADC3) U6.A2(OUT)
VSWR_EN: R21.1 U4.40(PB5/LPTIM1_IN1) U6.C2(EN)
NetC16_1: C16.1 T3.3(D2) U6.A1(VDD)
NetR19_2: R19.2 U5.4(TR)
NetR20_1: R20.1 T3.5(G2) T3.6(D1)
NetR21_2: R21.2 R22.2 T3.2(G1)
NetU4_26: U4.26(ANT) U5.3(OUT)
NetU5_6: U5.6(CP) U6.B1(RFIN)

Not connected (* = marked no-connect by the designer): U4 8(DBG_SX1276_DIO2)* 9(DBG_SX1276_DIO3)* 10(SX1276_DIO4)* 11(DBG_SX1276_DIO5)* 12(DBG_SX1276_DIO1)* 13(DBG_SX1276_DIO0)* 28(DBG_CRF1)* 29(DBG_CRF3)* 30(DBG_CRF2)* 31(STSAFE_nRST)* 47(TCXO_OUT)*

### Notes on the sheet
- 1,65uA
- 5,9mA
- Size: A3
- Revision:
- Sheet
- of

### Library data of the parts
C11 C14 C16 = C - 100nF/0402: as C8 on sheet MAIN; Supplier 1: Farnell; Manufacturer: Multicomp; Manufacturer Part Number: MC0402X104J160CT; Stock 1: 3230; Pricing 1: 10=0.0139, 100=0.0108, 500=0.0076, 2500=0.0051, 5000=0.0038 (EUR); Case Code (Metric): 1005; Case Code (Imperial): 0402; Min Operating Temperature: -55°C; Max Operating Temperature: 85°C; Capacitance: 100nF; Dielectric: X5R; Packaging: Tape and Reel; Tolerance: 5%; Voltage Rating (DC): 16V; REACH SVHC: No SVHC; ComponentLink1URL: http://www.farnell.com/datasheets/2117933.pdf; ComponentLink1Description: http://www.farnell.com/datasheets/2117933.pdf; ComponentLink2URL: http://www.farnell.com/datasheets/2117900.pdf; ComponentLink2Description: http://www.farnell.com/datasheets/2117900.pdf; Supplier Part Number 1: 2627419
C12 = 10uF: 10uf/0603/20%; Manufacturer: KEMET; Manufacturer Part Number: C0603C106M8PACTU; Stock 1: 0; Pricing 1: 10=0.555, 100=0.315, 500=0.238, 1000=0.2, 2000=0.174, 4000=0.143, 20000=0.123 (GBP); Supplier 1: Farnell; Supplier Part Number 1: 2456110
C13 C15 = C - 1uF/0402: as C9 on sheet MAIN; Stock 1: 0; Pricing 1: 10=0.0379, 100=0.0266, 500=0.0156, 2500=0.0098, 5000=0.0083 (EUR); Mount: Surface Mount; Case/Package: 0402; Case Code (Metric): 1005; Case Code (Imperial): 0402; Min Operating Temperature: -55°C; Max Operating Temperature: 85°C; Capacitance: 1uF; Tolerance: 20%; Voltage Rating: 10V; Packaging: Tape and Reel; Package Quantity: 1; Dielectric: X5R; Voltage: 10V; Voltage Rating (DC): 10V; Length: 1mm; Height: 0.5mm; Width: 0.02inch; Thickness: 0.022inch; Depth: 0.5mm; Radiation Hardening: No; REACH SVHC: No SVHC; Lead Free: Lead Free; ComponentLink1URL: https://datasheet.ciiva.com/164/product-164665.pdf; ComponentLink1Description: https://datasheet.ciiva.com/164/product-164665.pdf; ComponentLink2URL: https://datasheet.ciiva.com/11616/product-11616508.pdf; ComponentLink2Description: https://datasheet.ciiva.com/11616/product-11616508.pdf; ComponentLink3URL: https://datasheet.ciiva.com/46418/1769893-46418047.pdf; ComponentLink3Description: https://datasheet.ciiva.com/46418/1769893-46418047.pdf; ComponentLink4URL: https://datasheet.ciiva.com/164/partnumbering-e-01-164666.pdf; ComponentLink4Description: https://datasheet.ciiva.com/164/partnumbering-e-01-164666.pdf; ComponentLink5URL: https://datasheet.ciiva.com/164/partnumbering-e-01-164667.pdf; ComponentLink5Description: https://datasheet.ciiva.com/164/partnumbering-e-01-164667.pdf; Supplier 1: Farnell; Supplier Part Number 1: 1740588
C17 = C - 10nF/0402: as C10 on sheet MAIN; Supplier 1: Farnell; Stock 1: 16478; Pricing 1: 10=0.0216, 100=0.0151, 500=0.0104, 2500=0.0069, 5000=0.0056 (EUR); Mount: Surface Mount; Case/Package: 0402; Number of Pins: 2; Case Code (Metric): 1005; Case Code (Imperial): 0402; Min Operating Temperature: -55°C; Max Operating Temperature: 125°C; Package Quantity: 1; Capacitance: 10nF; Voltage Rating: 16V; Packaging: Tape and Reel; Voltage Rating (DC): 16V; Dielectric: X7R; Termination: SMD/SMT; Voltage: 16V; Length: 1mm; Height: 0.5mm; Width: 0.02inch; Thickness: 0.022inch; Depth: 0.5mm; Radiation Hardening: No; REACH SVHC: No SVHC; Lead Free: Lead Free; ComponentLink1URL: https://datasheet.ciiva.com/129/partnumbering-e-01-129774.pdf; ComponentLink1Description: https://datasheet.ciiva.com/129/partnumbering-e-01-129774.pdf; ComponentLink2URL: https://datasheet.ciiva.com/129/partnumbering-e-01-129775.pdf; ComponentLink2Description: https://datasheet.ciiva.com/129/partnumbering-e-01-129775.pdf; ComponentLink3URL: https://datasheet.ciiva.com/129/product-129776.pdf; ComponentLink3Description: https://datasheet.ciiva.com/129/product-129776.pdf; ComponentLink4URL: https://datasheet.ciiva.com/18184/getdatasheetpartid-178863-18184649.pdf; ComponentLink4Description: https://datasheet.ciiva.com/18184/getdatasheetpartid-178863-18184649.pdf; ComponentLink5URL: https://datasheet.ciiva.com/22698/608985-22698415.pdf; ComponentLink5Description: https://datasheet.ciiva.com/22698/608985-22698415.pdf; ComponentLink6URL: https://datasheet.ciiva.com/7937/608985-7937614.pdf; ComponentLink6Description: https://datasheet.ciiva.com/7937/608985-7937614.pdf; Supplier Part Number 1: 1828864
R17 R18 = R - 10k/0402: as R10 on sheet MAIN; Supplier 1: Farnell; Manufacturer: Multicomp; Manufacturer Part Number: MCWR04X1002FTL; Stock 1: 602609; Pricing 1: 10=0.0029, 100=0.0017, 500=0.0012, 2500=0.001, 5000=0.0008 (EUR); Case/Package: 0402; Case Code (Metric): 1005; Case Code (Imperial): 0402; Packaging: Cut Tape; Composition: Thick Film; Tolerance: 1%; Voltage Rating (DC): 50V; REACH SVHC: No SVHC; ComponentLink1URL: http://www.farnell.com/datasheets/1849611.pdf; ComponentLink1Description: http://www.farnell.com/datasheets/1849611.pdf; Supplier Part Number 1: 2447096
R19 = R - 50R: SMD Chip Resistor, 0402 [1005 Metric], 50 ohm, FC Series, 30 V, Thin Film, 50 mW; Manufacturer: Vishay; Manufacturer Part Number: CRCW060351R0FKEA; IRNAS Part No.: /; Resistance: 51R; Tolerance: 1%; Power Rating: 100mW; Voltage Rating: 75V; Temperature Coefficient: 100ppm/°C; Stock 1: 1083; Pricing 1: 10=0.0116, 250=0.0087, 500=0.0059, 1250=0.0052, 2500=0.0046 (GBP); Case/Package: 0603; Number of Pins: 2; Weight: 7.1E-05oz; Case Code (Imperial): 0603; Case Code (Metric): 1608; Contact Plating: Tin; Min Operating Temperature: -55°C; Max Operating Temperature: 155°C; Packaging: Tape and Reel; Package Quantity: 10; Composition: Thick Film; Number of Terminations: 2; Military Standard: Not; Termination: SMD/SMT; Max Power Dissipation: 100mW; Voltage Rating (DC): 75V; Working Voltage: 75V; Length: 1.55mm; Height: 0.45mm; Width: 0.85mm; Depth: 0.85mm; Radiation Hardening: No; REACH SVHC: Unknown; Lead Free: Lead Free; ComponentLink11URL: http://www.farnell.com/datasheets/2045976.pdf?_ga=2.23751994.1451481302.1563774341-1373726713.1554121096&_gac=1.92491119.1562763802.CjwKCAjwmZbpBRAGEiwADrmVXm8xT8OHDZvJe8qZIQyyGmIuiUD-TEITatw0hIdDkyBwIXXCH7oneRoCl7cQAvD_BwE; ComponentLink11Description: Datasheet; Supplier 1: Farnell; Supplier Part Number 1: 2309101
R20 R22 = R - 100k/0402: as R13 on sheet MAIN; Supplier 1: Farnell; Manufacturer: Multicomp; Manufacturer Part Number: MCWR04X1003FTL; Stock 1: 161188; Pricing 1: 10=0.0029, 100=0.0017, 500=0.0012, 2500=0.001, 5000=0.0008 (EUR); Mount: Surface Mount; Case/Package: 0402; Case Code (Metric): 1005; Case Code (Imperial): 0402; Tolerance: 1%; Packaging: Cut Tape; Composition: Thick Film; Voltage Rating (DC): 50V; REACH SVHC: No SVHC; ComponentLink1URL: https://datasheet.ciiva.com/46386/1849611-46386524.pdf; ComponentLink1Description: https://datasheet.ciiva.com/46386/1849611-46386524.pdf; Supplier Part Number 1: 2447094
R21 = R - 100R/0402: as R9 on sheet MAIN; Supplier 1: Farnell; Manufacturer: Multicomp; Manufacturer Part Number: MCMR04X1000FTL; Stock 1: 62365; Pricing 1: 10=0.0071, 100=0.0042, 500=0.003, 2500=0.0024, 5000=0.0019 (GBP); Case/Package: 0402; Case Code (Metric): 1005; Case Code (Imperial): 0402; Resistance: 100R; Tolerance: 1%; Composition: Ceramic; Packaging: Cut Tape; Voltage Rating (DC): 50V; REACH SVHC: No SVHC; ComponentLink1URL: https://datasheet.ciiva.com/28692/1716705-28692087.pdf; ComponentLink1Description: https://datasheet.ciiva.com/28692/1716705-28692087.pdf; ComponentLink2URL: https://datasheet.ciiva.com/22708/1716705-22708156.pdf; ComponentLink2Description: https://datasheet.ciiva.com/22708/1716705-22708156.pdf; Supplier Part Number 1: 2072515
T3 = T_M - VT6M1T2CR: as T2 on sheet MAIN; Author: Ciril Golob; Date: 11.07.2018; ComponentLINK1Description: Datasheet; ComponentLINK2Description: Datasheet www; ComponentLINK1URL: c:\ELRADSVN\Altium_Library\Libraries\Active\Datasheet\BSS123.pdf; ComponentLINK2URL: http://www.onsemi.com/pub/Collateral/BSS123-D.PDF; ComponentLink1Description: Datasheet; ComponentLink1URL: http://www.farnell.com/datasheets/2198041.pdf?_ga=2.191543850.1451481302.1563774341-1373726713.1554121096&_gac=1.95045230.1562763802.CjwKCAjwmZbpBRAGEiwADrmVXm8xT8OHDZvJe8qZIQyyGmIuiUD-TEITatw0hIdDkyBwIXXCH7oneRoCl7cQAvD_BwE; Supplier 1: Farnell; Supplier Part Number 1: 2706721
U4 = MCU - CMWX1ZZABZ: RF Module, FSK, OOK, LoRa, 4.8Kbps, 915MHz, -135.5dBm, 2.2V to 3.6V, I2C, SPI, UART, USB; Manufacturer: Murata; Manufacturer Part Number: CMWX1ZZABZ-091; Stock 1: 175; Pricing 1: 1=11.7, 5=11.06, 10=9.94, 50=9.54, 100=9.14, 250=8.05 (GBP); ComponentLink1Description: Datasheet; ComponentLink1URL: D:\altium\Altium_Library\Active\Datasheet\CMWX1ZZABZ.pdf; Supplier 1: Mouser; Supplier Part Number 1: 81-CMWX1ZZABZ-091
U5 = RF - HHM22106C1: Signal Conditioning DIRECTIONAL COUPLER 700-2700MHz; Manufacturer: u-blox; Manufacturer Part Number: MAX-M8Q-0; Stock 1: 10805; ComponentLink1Description: Datasheet; ComponentLink1URL: https://eu.mouser.com/datasheet/2/400/f_coupler_hhm22106c1_en-1308651.pdf; Supplier 1: Mouser; Supplier Part Number 1: 810-HHM22106C1
U6 = RF - LMH2110TMX: RF Detector IC GSM, EDGE, CDMA 50MHz ~ 8GHz -40dBm ~ 5dBm ±0,5dB; Manufacturer: u-blox; Manufacturer Part Number: MAX-M8Q-0; Stock 1: 10805; ComponentLink1Description: Datasheet; ComponentLink1URL: http://www.ti.com/lit/ds/symlink/lmh2110.pdf; Supplier 1: Mouser; Supplier Part Number 1: 926-LMH2110TMX/NOPB

## Sheet POWER.SchDoc
size A3; DocumentNumber: 4; SheetNumber: 4; SheetTotal: 5
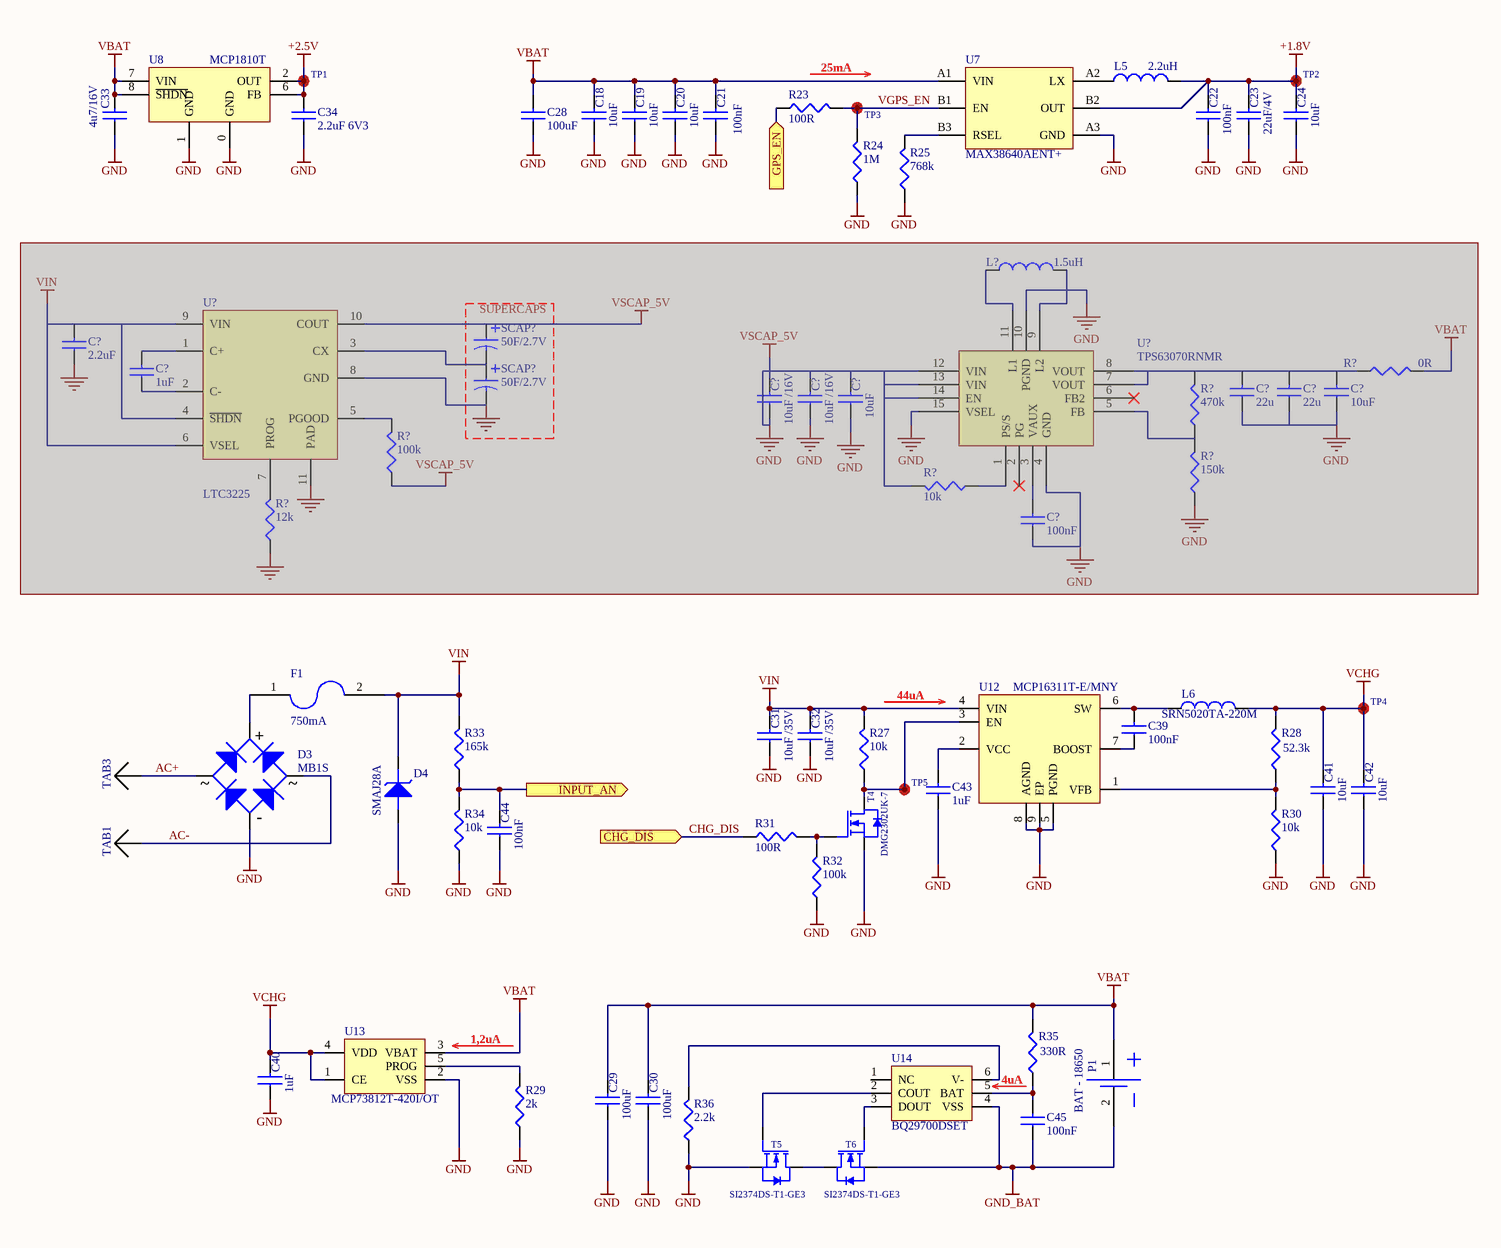
[diagram p3: POWER.SchDoc]

### Parts
(Parts that share a designator on the sheet are numbered #1, #2 ... from top to bottom, then left to right.)
C18  10uF  [CAP0603]
C19  10uF  [CAP0603]
C20  10uF  [CAP0603]
C21  100nF  [CAP0402]
C22  100nF  [CAP0402]
C23  22uF/4V  [CAP0603]
C24  10uF  [CAP0603]
C28  100uF  [CAP0805]
C29  100uF  [CAP0805]
C30  100uF  [CAP0805]
C31  10uF /35V  [CAP0805]
C32  10uF /35V  [CAP0805]
C33  4u7/16V  [CAP0603]
C34  2.2uF 6V3  [CAP0402]
C39  100nF  [CAP0402]
C40  1uF  [CAP0402]
C41  10uF  [CAP0603]
C42  10uF  [CAP0603]
C43  1uF  [CAP0402]
C44  100nF  [CAP0402]
C45  100nF  [CAP0402]
C?#1  2.2uF  [CAP0805]  (masked out: inside a compile mask, not in the netlist)
C?#2  1uF  [CAP0603]  (masked out: inside a compile mask, not in the netlist)
C?#3  10uF /16V  [CAP0805]  (masked out: inside a compile mask, not in the netlist)
C?#4  10uF /16V  [CAP0805]  (masked out: inside a compile mask, not in the netlist)
C?#5  22u  [CAP0805]  (masked out: inside a compile mask, not in the netlist)
C?#6  22u  [CAP0805]  (masked out: inside a compile mask, not in the netlist)
C?#7  10uF  [CAP0603]  (masked out: inside a compile mask, not in the netlist)
C?#8  10uF  [CAP0603]  (masked out: inside a compile mask, not in the netlist)
C?#9  100nF  [CAP0603]  (masked out: inside a compile mask, not in the netlist)
D3  MB1S  [MB1S]
D4  SMAJ28A  [DO-214AC (SMA)]
F1  750mA  [FUSE0603]
L5  2.2uH  [IND2.3X1.7]
L6  SRN5020TA-220M  [SRN5020TA]
L?  1.5uH  [FDSD0402]  (masked out: inside a compile mask, not in the netlist)
P1  BAT - 18650  [BATTERY 18650 - SMD TAB]
R23  100R  [RES0402]
R24  1M  [RES0402]
R25  768k  [RES0402]
R27  10k  [RES0402]
R28  52.3k  [RES0402]
R29  2k  [RES0402]
R30  10k  [RES0402]
R31  100R  [RES0402]
R32  100k  [RES0402]
R33  165k  [RES0402]
R34  10k  [RES0402]
R35  330R  [RES0402]
R36  2.2k  [RES0402]
R?#1  0R  [RES0603]  (masked out: inside a compile mask, not in the netlist)
R?#2  470k  [RES0603]  (masked out: inside a compile mask, not in the netlist)
R?#3  100k  [RES0603]  (masked out: inside a compile mask, not in the netlist)
R?#4  150k  [RES0603]  (masked out: inside a compile mask, not in the netlist)
R?#5  10k  [RES0603]  (masked out: inside a compile mask, not in the netlist)
R?#6  12k  [RES0603]  (masked out: inside a compile mask, not in the netlist)
SCAP?#1  50F/2.7V  [Super Capacitor Horizontal]  (masked out: inside a compile mask, not in the netlist)
SCAP?#2  50F/2.7V  [Super Capacitor Horizontal]  (masked out: inside a compile mask, not in the netlist)
T4  DMG2302UK-7  [SOT23-3AL]
T5  SI2374DS-T1-GE3  [SOT23-3AL]
T6  SI2374DS-T1-GE3  [SOT23-3AL]
TAB1  WP-SMBU SMD  [WP-SMBU]  (value not drawn)
TAB3  WP-SMBU SMD  [WP-SMBU]  (value not drawn)
TP1  TestPoint  [TestPoint:1.2x1.2mm]  (value not drawn)
TP2  TestPoint  [TestPoint:1.2x1.2mm]  (value not drawn)
TP3  TestPoint  [TestPoint:1.2x1.2mm]  (value not drawn)
TP4  TestPoint  [TestPoint:1.2x1.2mm]  (value not drawn)
TP5  TestPoint  [TestPoint:1.2x1.2mm]  (value not drawn)
U7  MAX38640AENT+  [WLP-6]
U8  MCP1810T  [VDFN_2x2]
U12  MCP16311T-E/MNY  [TDFN-8]
U13  MCP73812T-420I/OT  [SOT23-5]
U14  BQ29700DSET  [PWSON-6]
U?#1  LTC3225  [PSON50P200X80_HS-11N]  (masked out: inside a compile mask, not in the netlist)
U?#2  TPS63070RNMR  [VQFN TPS]  (masked out: inside a compile mask, not in the netlist)

### Blocks framed on the sheet
SUPERCAPS: SCAP?#1 SCAP?#2

### Ports
CHG_DIS (in), GPS_EN (in), INPUT_AN (out)

### Nets
+1.8V: C22.2 C23.2 C24.2 L5.2 TP2.0 U7.B2(OUT)
+2.5V: C34.2 TP1.0 U8.2(OUT) U8.6(FB)
GND: C18.1 C19.1 C20.1 C21.1 C22.1 C23.1 C24.1 C28.1 C29.1 C30.1 C31.1 C32.1 C33.1 C34.1 C40.1 C41.1 C42.1 C43.1 C44.1 D3.2(cathode) D4.A(ANODE) R24.1 R25.1 R29.1 R30.1 R32.1 R34.1 R36.1 T4.2(S) T5.2(S) U7.A3(GND) U8.0(GND) U8.1(GND) U12.5(PGND) U12.8(AGND) U12.9(EP) U13.2(VSS)
GND_BAT: C45.1 P1.2 T6.2(S) U14.4(VSS)
VBAT: C18.2 C19.2 C20.2 C21.2 C28.2 C29.2 C30.2 C33.2 P1.1 R35.2 U7.A1(VIN) U8.7(VIN) U8.8(~{SHDN}) U13.3(VBAT)
VCHG: C40.2 C41.2 C42.2 L6.2 R28.2 TP4.0 U13.1(CE) U13.4(VDD)
VIN: C31.2 C32.2 D4.K(cathode) F1.2 R27.2 R33.2 U12.4(VIN)
AC+: D3.4(cathode) TAB3.1(ALERT)
AC-: D3.3(cathode) TAB1.1(ALERT)
CHG_DIS: R31.1 ; port CHG_DIS
GPS_EN: R23.1 ; port GPS_EN
INPUT_AN: C44.2 R33.1 R34.2 ; port INPUT_AN
VGPS_EN: R23.2 R24.2 TP3.0 U7.B1(EN)
NetC39_1: C39.1 U12.7(BOOST)
NetC39_2: C39.2 L6.1 U12.6(SW)
NetC43_2: C43.2 U12.2(VCC)
NetC45_2: C45.2 R35.1 U14.5(BAT)
NetD3_1: D3.1(cathode) F1.1
NetL5_1: L5.1 U7.A2(LX)
NetR25_2: R25.2 U7.B3(RSEL)
NetR27_1: R27.1 T4.3(D) TP5.0 U12.3(EN)
NetR28_1: R28.1 R30.2 U12.1(VFB)
NetR29_2: R29.2 U13.5(PROG)
NetR31_2: R31.2 R32.2 T4.1(G)
NetR36_2: R36.2 U14.6(V-)
NetT5_1: T5.1(G) U14.2(COUT)
NetT5_3: T5.3(D) T6.3(D)
NetT6_1: T6.1(G) U14.3(DOUT)

Not connected (* = marked no-connect by the designer): U14 1(NC)

### Notes on the sheet
- 25mA
- 44uA
- 1,2uA
- (near R35) 4uA
- Size: A3
- Revision:
- Sheet
- of
- (in symbol D_GREZ - MB1S) +; ~